# EAGLE design single-board (EAGLE 7.5.0)
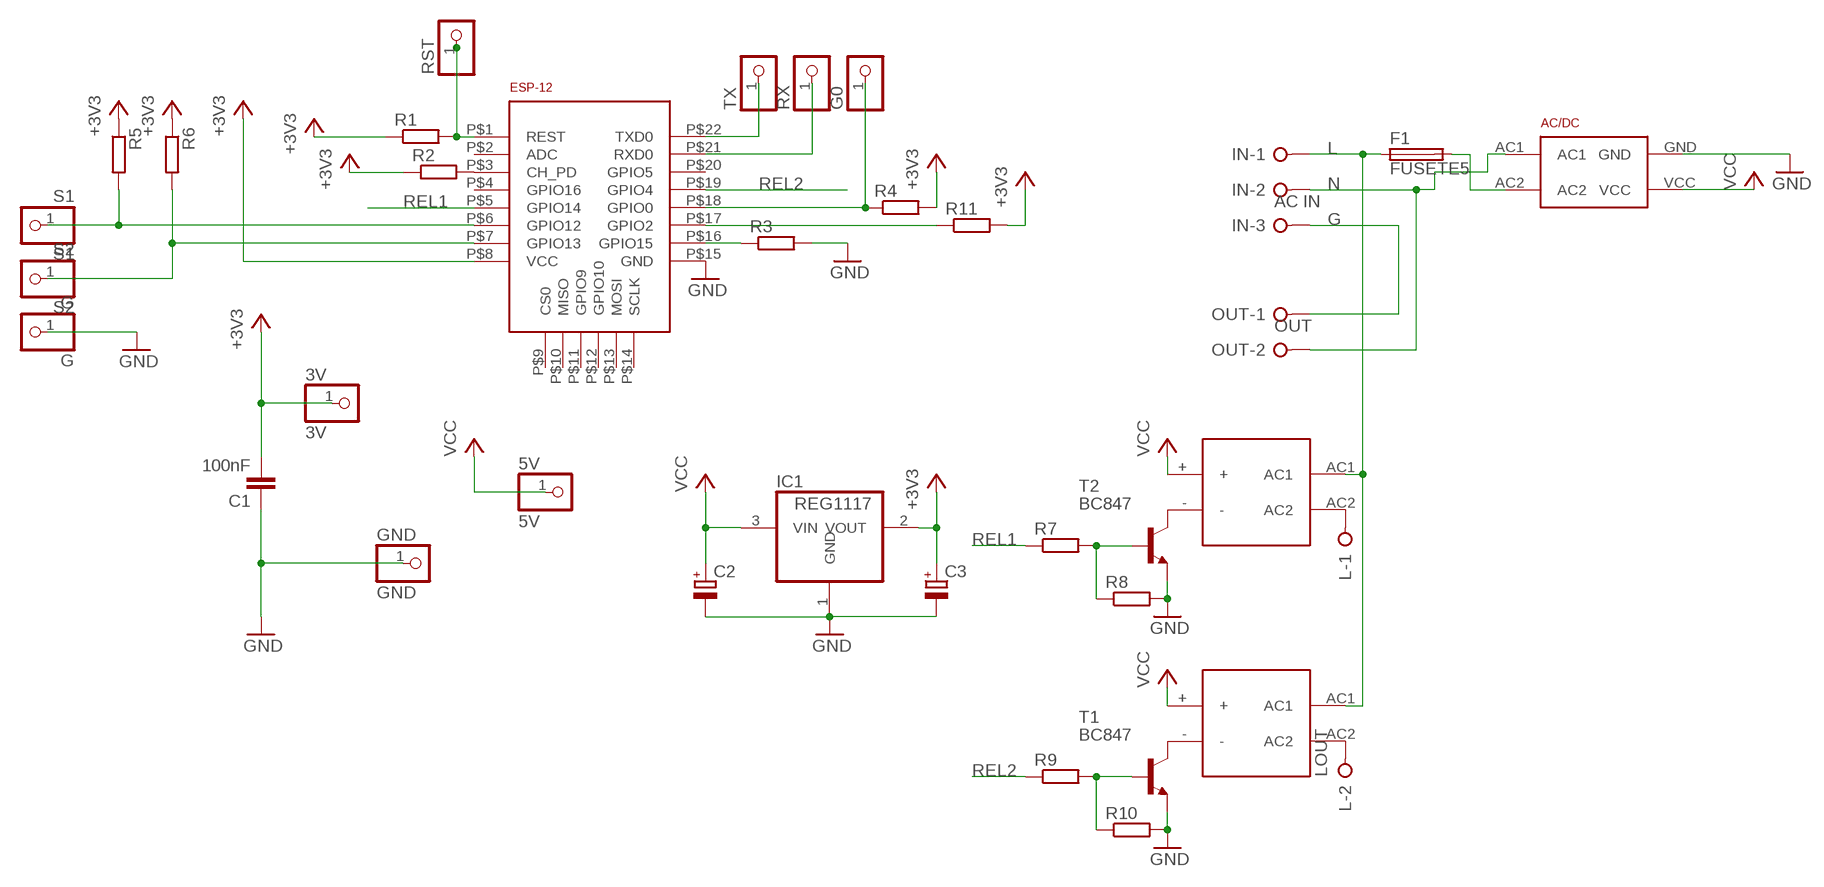
[diagram p0: schematic, sheet 1]

## Parts
3V  3V  PINHD-1X1  [1X01]
5V  5V  PINHD-1X1  [1X01]
AC/DC  HLK-PM01  [HLK-PM01]
C1  100nF  C-EUC0805K  [C0805K]
C2  CPOL-EUA/3216-18R  [A/3216-18R]
C3  CPOL-EUA/3216-18R  [A/3216-18R]
ESP-12  ESP-12EESP12E-SMD  [ESP12E-SMD]
F1  FUSETE5  [TE5]
G  G  PINHD-1X1  [1X01]
G0  PINHD-1X1  [1X01]
GND  GND  PINHD-1X1  [1X01]
IC1  REG1117  [SOT223]
IN  AC IN  W237-03P  [W237-133]
L  LOUT  W237-02P  [W237-132]
OUT  OUT  W237-02P  [W237-132]
R1  R-EU_R0805  [R0805]
R2  R-EU_R0805  [R0805]
R3  R-EU_R0805  [R0805]
R4  R-EU_R0805  [R0805]
R5  R-EU_R0805  [R0805]
R6  R-EU_R0805  [R0805]
R7  R-EU_R0805  [R0805]
R8  R-EU_R0805  [R0805]
R9  R-EU_R0805  [R0805]
R10  R-EU_R0805  [R0805]
R11  R-EU_R0805  [R0805]
RST  PINHD-1X1  [1X01]
RX  PINHD-1X1  [1X01]
S1  S1  PINHD-1X1  [1X01]
S2  S2  PINHD-1X1  [1X01]
T1  BC847  [SOT23]
T2  BC847  [SOT23]
TX  PINHD-1X1  [1X01]
U$2  G3MB-202P  [G3MB-202P]
U$3  G3MB-202P  [G3MB-202P]

## Nets
+3V3: 3V.1 C1.2 C3.+ ESP-12.P$8(VCC) IC1.2(VOUT) R1.1 R2.1 R4.2 R5.1 R6.1 R11.2
G [HV]: IN.3 OUT.1
GND: AC/DC.GND C1.1 C2.- C3.- ESP-12.P$15(GND) G.1 GND.1 IC1.1(GND) R3.2 R8.2 R10.2 T1.2(E) T2.2(E)
L [HV]: F1.1 IN.1 U$2.AC1 U$3.AC1
N [HV]: AC/DC.AC1 IN.2 OUT.2
N$1: ESP-12.P$1(REST) R1.2 RST.1
N$2: ESP-12.P$3(CH_PD) R2.2
N$3: ESP-12.P$16(GPIO15) R3.1
N$4: ESP-12.P$18(GPIO0) G0.1 R4.1
N$5: ESP-12.P$22(TXD0) TX.1
N$6: ESP-12.P$21(RXD0) RX.1
N$7 [HV]: AC/DC.AC2 F1.2
N$8 [HV]: L.2 U$3.AC2
N$9 [HV]: L.1 U$2.AC2
N$12: T2.3(C) U$2.-
N$13: T1.3(C) U$3.-
N$14: R7.2 R8.1 T2.1(B)
N$16: R9.2 R10.1 T1.1(B)
N$17: ESP-12.P$17(GPIO2) R11.1
REL1: ESP-12.P$5(GPIO14) R7.1
REL2: ESP-12.P$19(GPIO4) R9.1
SW1: ESP-12.P$6(GPIO12) R5.2 S1.1
SW2: ESP-12.P$7(GPIO13) R6.2 S2.1
VCC: 5V.1 AC/DC.VCC C2.+ IC1.3(VIN) U$2.+ U$3.+
Unconnected: ESP-12.P$2(ADC) ESP-12.P$4(GPIO16) ESP-12.P$9(CS0) ESP-12.P$10(MISO) ESP-12.P$11(GPIO9) ESP-12.P$12(GPIO10) ESP-12.P$13(MOSI) ESP-12.P$14(SCLK) ESP-12.P$20(GPIO5)

## Library data of the parts
3V 5V G G0 GND RST RX S1 S2 TX = pinhead:PINHD-1X1: PIN HEADER
AC/DC = uoo-light:HLK-PM01
C1 = rcl:C-EU: CAPACITOR, European symbol
C2 C3 = rcl:CPOL-EU: POLARIZED CAPACITOR, European symbol
ESP-12 = uoo-light:ESP-12E
F1 = fuse:FUSE: Fuse; OC_FARNELL: unknown; OC_NEWARK: unknown
IC1 = burr-brown:REG1117: 800mA and 1A Low Dropout (LDO) Positive Regulator 1.8V, 2.5V, 2.85V, 3.3V, 5V, and Adj; MPN: REG1117; OC_FARNELL: 1097566; OC_NEWARK: 14P6981
IN = con-wago-508:W237-03P: WAGO SREW CLAMP; OC_FARNELL: unknown; OC_NEWARK: unknown
L OUT = con-wago-508:W237-02P: WAGO SREW CLAMP; OC_FARNELL: unknown; OC_NEWARK: unknown
R1-R11 = rcl:R-EU_: RESISTOR, European symbol
T1 T2 = transistor:BC847: NPN TRANSISTOR
U$2 U$3 = uoo-light:G3MB-202P

## Net classes
0 default: width 0.406 mm, clearance 0.203 mm
1 HV: width 0.889 mm, clearance 1.499 mm

## Board
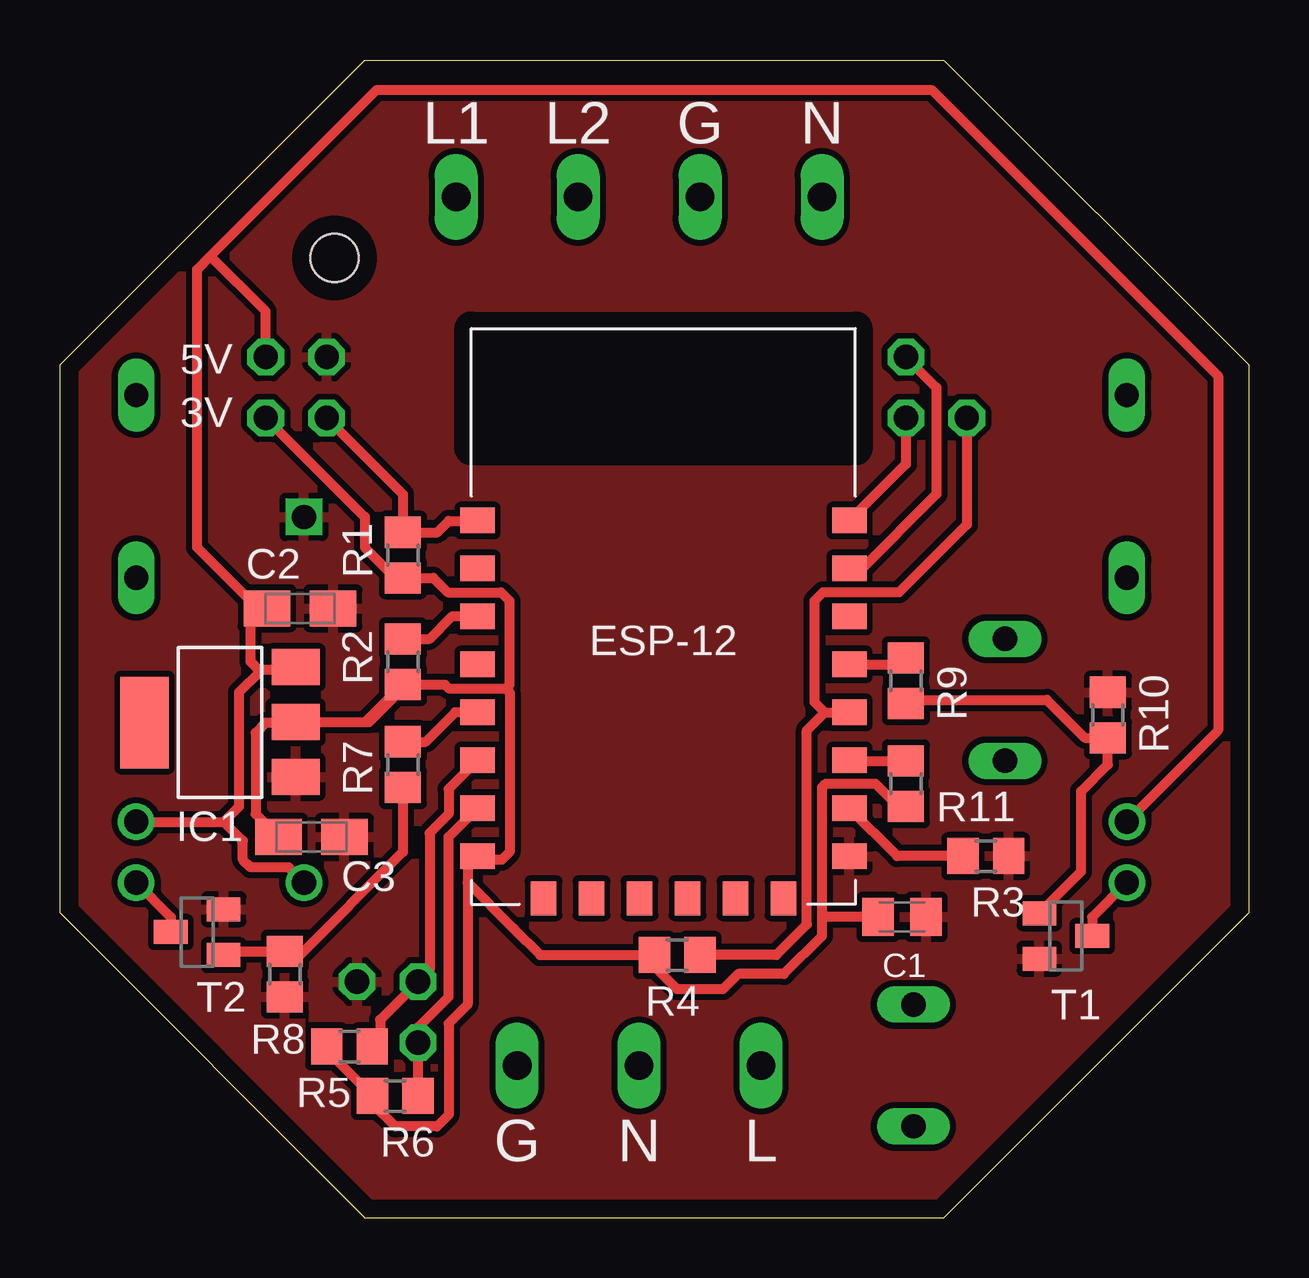
[diagram p1: board, top side]
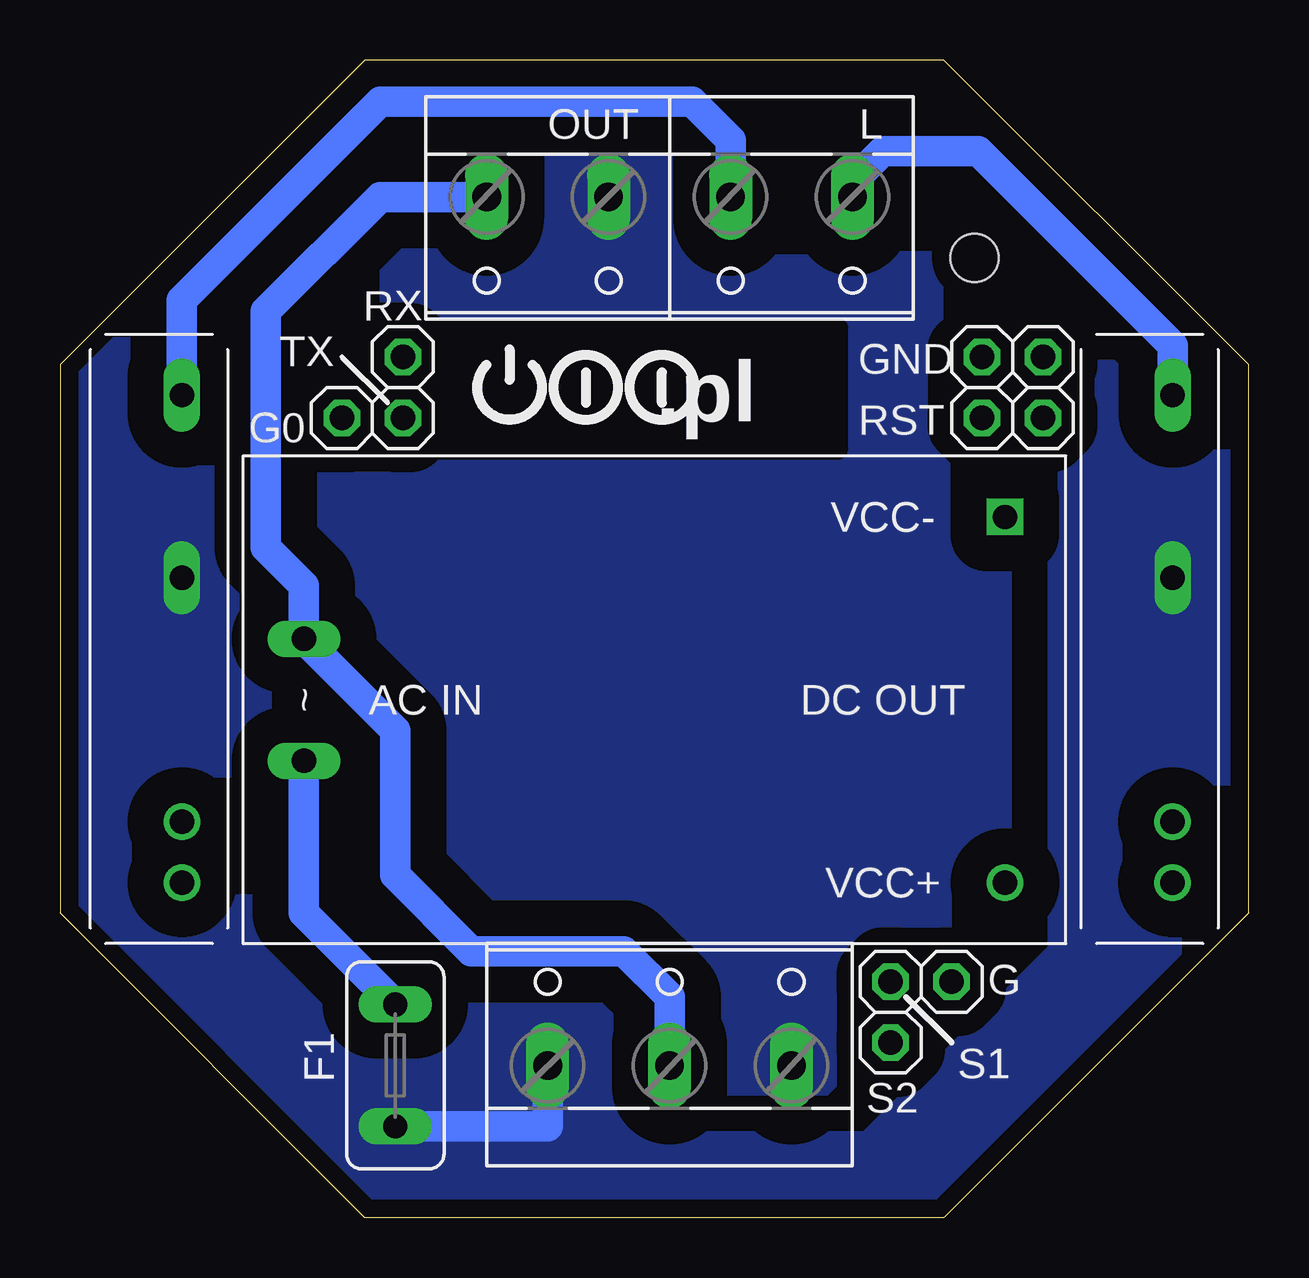
[diagram p2: board, bottom side, seen from below]

Size 49.53 x 48.26 mm. Coordinates in mm from the lower left corner, seen from the top.
Outline: 0,12.7 0,35.56 12.7,48.26 36.83,48.26 49.53,35.56 49.53,12.7 36.83,0 12.7,0 0,12.7
Copper layers (1*16): Top 0.035mm / dielectric 1.5mm / Bottom 0.035mm
Design rules "default *": minimum track width 10mil, minimum drill 24mil, track to track 8mil, track to pad 8mil, pad to pad 8mil, via to via 8mil, smd to smd 8mil, copper to edge 30mil, drill to drill 8mil, minimum pad ring 10mil, minimum via ring 8mil, stop-mask expansion 4mil, vias tented up to drill 0mil, thermal gap 10mil
Holes 2 mm at 11.43,40.01

### Footprints (pad centres in the part's own frame; a part is rotated, then mirrored left to right if it is on the bottom)
1X01 = drill 1.016 octagon: 1 0,0
HLK-PM01 = drill 1.016 long: AC1 -14.605,2.54; AC2 -14.605,-2.54 | drill 1.016 square: GND 14.605,7.62 | drill 1.016: VCC 14.605,-7.62
C0805K = smd 1.3 x 1.6: 1 -1,0; 2 1,0
A/3216-18R = smd 1.95 x 1.5: + 1.375,0; - -1.375,0
ESP12E-SMD = smd 1.422 x 1.067: P$1 0.25,-8; P$2 0.25,-10; P$3 0.25,-12; P$4 0.25,-14; P$5 0.25,-16; P$6 0.25,-18; P$7 0.25,-20; P$8 0.25,-22; P$15 15.75,-22; P$16 15.75,-20; P$17 15.75,-18; P$18 15.75,-16; P$19 15.75,-14; P$20 15.75,-12; P$21 15.75,-10; P$22 15.75,-8 | smd 1.067 x 1.422: P$9 3,-23.75; P$10 5,-23.75; P$11 7,-23.75; P$12 9,-23.75; P$13 11,-23.75; P$14 13,-23.75
TE5 = drill 1.016 long: 1 -2.54,0; 2 2.54,0
SOT223 = smd 1.499 x 2.007: 1 -2.261,-3.15; 2 0.025,-3.15; 3 2.311,-3.15 | smd 3.81 x 2.007: 4 0,3.15
W237-133 = drill 1.194 long: 1 -5.08,-0.635; 2 0,-0.635; 3 5.08,-0.635
W237-132 = drill 1.194 long: 1 -2.54,-0.635; 2 2.54,-0.635
R0805 = smd 1.3 x 1.5: 1 -0.95,0; 2 0.95,0
SOT23 = smd 1 x 1.4: 1 -0.95,-1.1; 2 0.95,-1.1; 3 0,1.1
G3MB-202P = drill 1.016: + 2.54,0; - 0,0 | drill 1.016 long: AC1 12.7,0; AC2 20.32,0

### Placement (x,y rotation side)
3V  8.57,33.34 0 bottom
5V  8.57,35.88 0 bottom
AC/DC  24.77,21.59 0 bottom
C1  35.08,12.54 180 top
C2  10,25.4 180 top
C3  10.48,15.88 180 top
ESP-12  17.14,37.07 0 top
F1  35.56,6.35 90 bottom
G  12.38,9.84 0 bottom
G0  37.78,33.34 0 bottom
GND  11.11,35.88 0 bottom
IC1  6.67,20.64 90 top
IN  24.13,6.99 0 bottom
L  19.05,41.91 180 bottom
OUT  29.21,41.91 180 bottom
R1  14.29,27.62 90 top
R2  14.29,23.18 90 top
R3  38.58,15.08 0 top
R4  25.72,10.95 180 top
R5  12.07,7.14 0 top
R6  13.97,5.08 0 top
R7  14.29,18.89 270 top
R8  9.37,10.16 270 top
R9  35.24,22.38 270 top
R10  43.66,20.95 90 top
R11  35.24,18.1 270 top
RST  11.11,33.34 180 bottom
RX  35.24,35.88 0 bottom
S1  14.92,9.84 0 bottom
S2  14.92,7.3 0 bottom
T1  41.91,11.75 270 top
T2  5.72,11.91 90 top
TX  35.24,33.34 0 bottom
U$2  3.17,13.97 90 bottom
U$3  44.45,13.97 90 bottom

### Tracks (layer width: path | path; a pad name or v marks a point on that pad's centre or on a via)
+3V3
  Top 0.406: 9.63,20.64 8.57,20.64 8.15,20.21 8.15,16.83 C3.+ | 9.63,20.64 9.79,20.64 | R5.1 11.11,6.99 R6.1 13.02,4.76 13.97,3.81 15.72,3.81 16.19,4.29 16.19,8.1 16.99,8.89 16.99,13.97 | 16.99,13.97 16.99,14.66 ESP-12.P$8 17.54,14.92 18.41,14.92 18.73,15.24 18.73,21.91 18.57,22.07 | 12.72,20.66 IC1.2 9.63,20.75 9.63,20.64 | 12.72,20.66 R2.1 | 12.72,20.66 12.88,20.66 14.45,22.22 16.03,22.22 16.19,22.07 18.57,22.07 | 16.99,13.97 18.89,12.07 20,10.95 R4.2 24.77,10.48 25.72,9.52 27.62,9.52 28.26,10.16 30.16,10.16 31.75,11.75 31.75,12.7 | 31.75,12.7 31.75,17.94 31.91,18.1 33.97,18.1 35.08,16.99 R11.2 | C1.2 31.91,12.54 31.75,12.7 | 18.57,22.07 18.73,22.22 18.73,25.72 18.38,26.07 16.16,26.07 15.56,26.67 R1.1 13.97,26.67 12.7,27.94 12.7,29.21 3V.1
G
  pour Bottom (rank 4, no thermals): 0,35.56 12.7,48.26 36.83,48.26 49.53,35.56 49.53,12.7 36.83,0 12.7,0 0,12.7
GND
  pour Top (isolate 0.254): 0,35.56 0,12.7 12.7,0 36.83,0 49.53,12.7 49.53,35.56 36.83,48.26 12.7,48.26
L
  Bottom 1.27: IN.1 29.21,3.81 F1.1
  pour Bottom (rank 2, no thermals): 0,35.56 7.94,43.5 7.94,11.11 15.88,3.17 24.13,3.17 24.13,8.89 36.51,8.89 36.51,20 43.18,26.67 43.18,41.91 49.53,35.56 49.53,12.7 36.83,0 12.7,0 0,12.7
N
  Bottom 1.27: OUT.2 36.2,42.55 40.96,37.78 40.96,27.94 39.37,26.35 AC/DC.AC1 35.56,20.32 35.56,14.29 32.39,11.11 26.04,11.11 24.13,9.21 IN.2
N$1
  Top 0.406: ESP-12.P$1 17.38,29.05 16.19,29.05 15.71,28.57 R1.2 14.29,30.16 RST.1
N$2
  Top 0.406: R2.2 15.4,24.13 16.35,25.08 17.38,25.08 ESP-12.P$3
N$3
  Top 0.406: R3.1 34.88,15.08 ESP-12.P$16
N$4
  Top 0.406: 31.86,21.07 31.11,20.32 31.11,12.22 29.85,10.95 R4.1 | 31.86,21.07 ESP-12.P$18 | 31.86,21.07 31.43,21.5 31.43,25.72 31.78,26.07 34.96,26.07 37.78,28.89 G0.1
N$5
  Top 0.406: 32.9,29.08 ESP-12.P$22 35.24,31.42 TX.1
N$6
  Top 0.406: RX.1 36.51,34.61 36.51,30.16 33.34,26.99 32.98,26.99 ESP-12.P$21
N$7
  Bottom 1.27: F1.2 39.37,12.7 AC/DC.AC2
N$8
  Bottom 1.27: L.2 21.59,44.93 23.18,46.51 36.2,46.51 44.45,38.26 U$3.AC2
N$9
  Bottom 1.27: U$2.AC2 3.17,36.35 11.27,44.45 15.24,44.45 16.51,43.18 L.1
N$12
  Top 0.406: U$2.- 4.62,12.53 T2.3
N$13
  Top 0.406: U$3.- 43.01,12.53 T1.3
N$14
  Top 0.406: 9.2,11.27 R8.1 | R7.2 14.29,15.24 9.84,10.8 9.68,10.8 R8.1 | T2.1 6.97,11.11 R8.1
N$16
  Top 0.406: R9.2 35.24,21.59 41.12,21.59 42.7,20 R10.1 43.66,18.89 42.55,17.78 42.55,14.43 T1.1
N$17
  Top 0.406: ESP-12.P$17 32.92,19.05 R11.1
REL1
  Top 0.406: R7.1 15.24,19.84 16.46,21.07 ESP-12.P$5
REL2
  Top 0.406: ESP-12.P$19 35.19,23.07 R9.1
SW1
  Top 0.406: R5.2 13.02,7.46 13.34,7.78 13.34,8.25 S1.1 15.4,10.32 15.4,16.03 16.19,16.83 16.19,17.86 ESP-12.P$6
SW2
  Top 0.406: R6.2 S2.1 14.92,7.94 16.19,9.21 16.19,15.88 ESP-12.P$7
VCC
  Top 0.406: 8.33,22.78 7.46,21.91 7.46,17.14 6.83,16.51 | 8.33,22.78 8.41,22.86 9.73,22.86 IC1.3 | AC/DC.VCC 9.52,14.61 7.94,14.61 7.62,14.92 7.62,15.72 6.83,16.51 | 8.33,22.78 7.94,23.18 7.94,24.87 | 7.94,24.87 C2.+ | 6.27,40.08 13.18,46.99 36.35,46.99 48.26,35.08 48.26,20.32 U$3.+ | U$2.+ 6.83,16.51 | 5V.1 8.57,37.78 6.27,40.08 | 7.94,24.87 7.94,25.72 5.72,27.94 5.72,39.53 6.27,40.08

### Text on the board
tPlace: L1 | L2 | G | N | G | N | L
bPlace: .pl
bStop: uoo-light